# EAGLE schematic Controller (EAGLE 6.5.0)
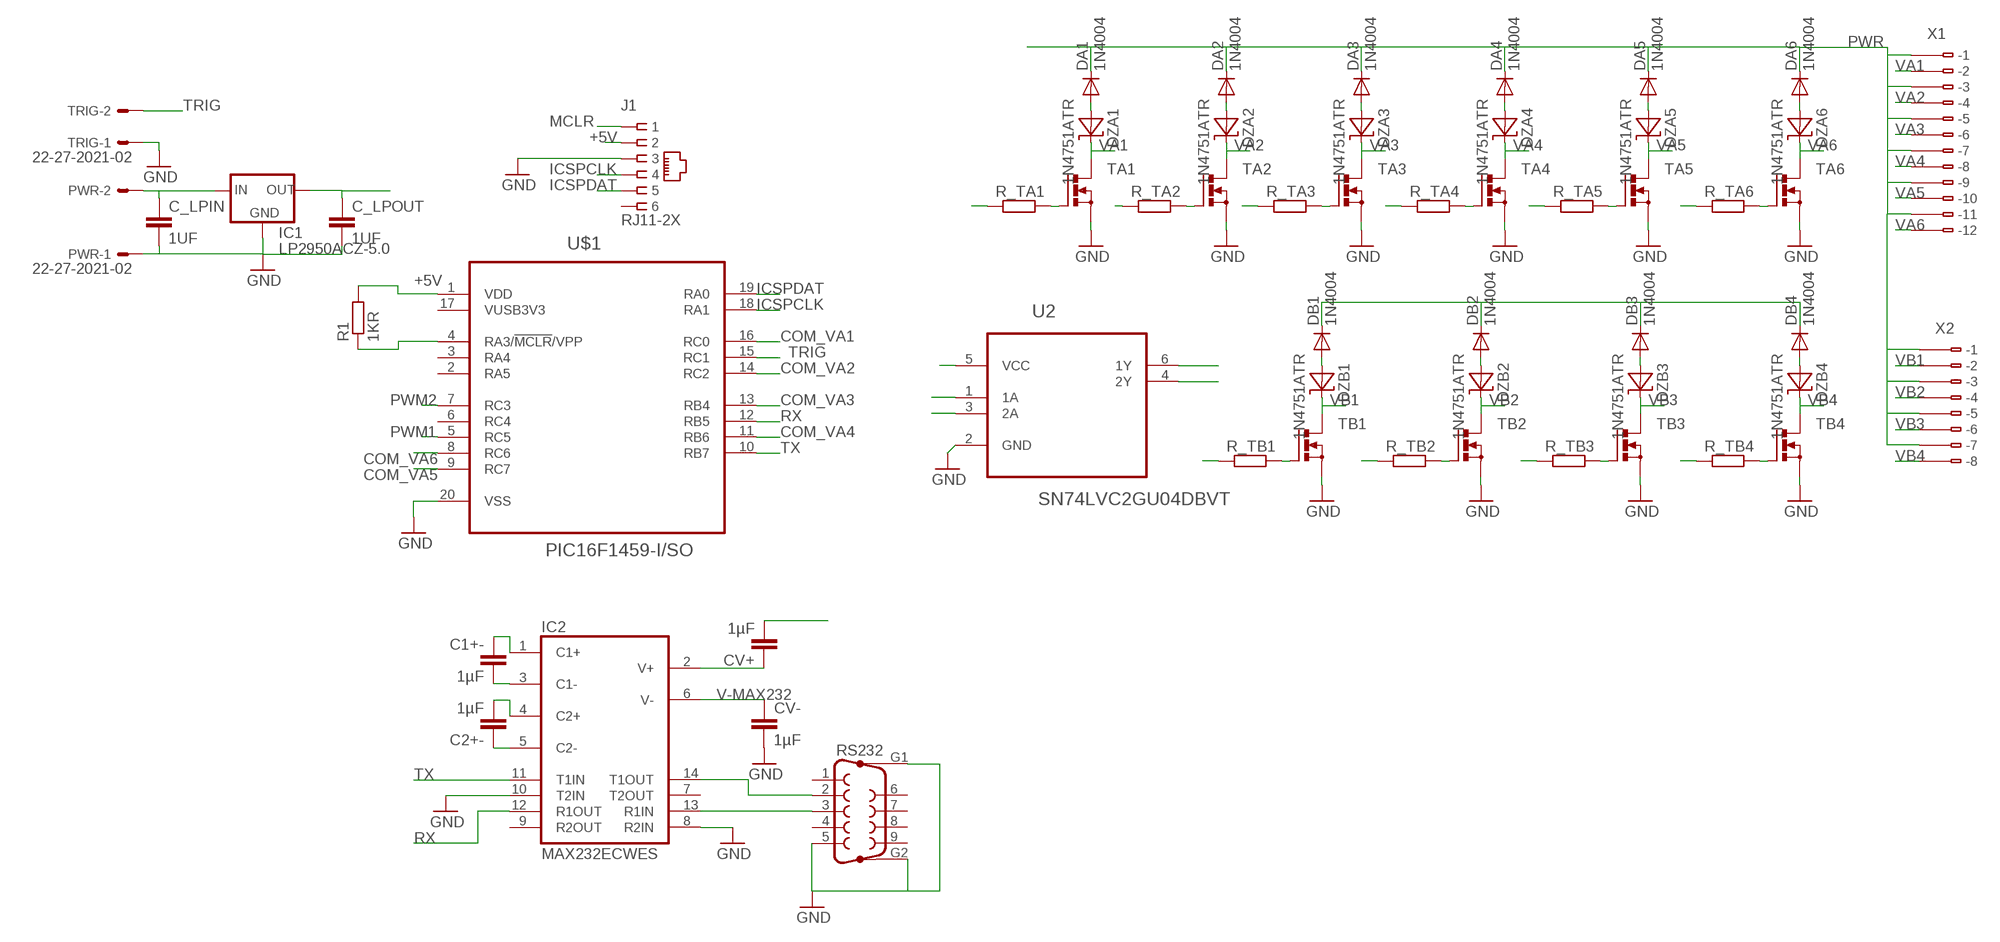
[diagram p0: schematic, sheet 1]

## Parts
C1+-  1µF  C-EUC0805  [C0805]
C2+-  1µF  C-EUC0805  [C0805]
C_LPIN  1UF  C-EUC0805  [C0805]
C_LPOUT  1UF  C-EUC0805  [C0805]
CV+  1µF  C-EUC0805  [C0805]
CV-  1µF  C-EUC0805  [C0805]
DA1  1N4004  [DO41-10]
DA2  1N4004  [DO41-10]
DA3  1N4004  [DO41-10]
DA4  1N4004  [DO41-10]
DA5  1N4004  [DO41-10]
DA6  1N4004  [DO41-10]
DB1  1N4004  [DO41-10]
DB2  1N4004  [DO41-10]
DB3  1N4004  [DO41-10]
DB4  1N4004  [DO41-10]
DZA1  1N4751ATR  [DO41-7]
DZA2  1N4751ATR  [DO41-7]
DZA3  1N4751ATR  [DO41-7]
DZA4  1N4751ATR  [DO41-7]
DZA5  1N4751ATR  [DO41-7]
DZA6  1N4751ATR  [DO41-7]
DZB1  1N4751ATR  [DO41-7]
DZB2  1N4751ATR  [DO41-7]
DZB3  1N4751ATR  [DO41-7]
DZB4  1N4751ATR  [DO41-7]
IC1  LP2950ACZ-5.0  [TO92]
IC2  MAX232ECWES  [SO16]
J1  RJ11-2X  [RJ11-NO_SHIELD]
PWR  22-27-2021-02  [6410-02]
R1  1KR  R-EU_R0805  [R0805]
R_TA1  R-EU_R0805  [R0805]
R_TA2  R-EU_R0805  [R0805]
R_TA3  R-EU_R0805  [R0805]
R_TA4  R-EU_R0805  [R0805]
R_TA5  R-EU_R0805  [R0805]
R_TA6  R-EU_R0805  [R0805]
R_TB1  R-EU_R0805  [R0805]
R_TB2  R-EU_R0805  [R0805]
R_TB3  R-EU_R0805  [R0805]
R_TB4  R-EU_R0805  [R0805]
RS232  F09HP  [F09HP]
TA1  BSS316N  [INF-PG-SOT23_N_1PRIMARY]
TA2  BSS316N  [INF-PG-SOT23_N_1PRIMARY]
TA3  BSS316N  [INF-PG-SOT23_N_1PRIMARY]
TA4  BSS316N  [INF-PG-SOT23_N_1PRIMARY]
TA5  BSS316N  [INF-PG-SOT23_N_1PRIMARY]
TA6  BSS316N  [INF-PG-SOT23_N_1PRIMARY]
TB1  BSS316N  [INF-PG-SOT23_N_1PRIMARY]
TB2  BSS316N  [INF-PG-SOT23_N_1PRIMARY]
TB3  BSS316N  [INF-PG-SOT23_N_1PRIMARY]
TB4  BSS316N  [INF-PG-SOT23_N_1PRIMARY]
TRIG  22-27-2021-02  [6410-02]
U2  SN74LVC2GU04DBVT  [SOT95P280X145-6N]
U$1  PIC16F1459-I/SO  [SOIC127P1030X265-20N]
X1  233-212  [233-212]
X2  233-208  [233-208]

## Nets
+5V: C_LPOUT.1 CV+.2 IC1.1(OUT) J1.2 R1.2 U2.5(VCC) U$1.1(VDD)
COM_VA1: R_TA1.1 U$1.16(RC0)
COM_VA2: R_TA2.1 U$1.14(RC2)
COM_VA3: R_TA3.1 U$1.13(RB4)
COM_VA4: R_TA4.1 U$1.11(RB6)
COM_VA5: R_TA5.1 U$1.9(RC7)
COM_VA6: R_TA6.1 U$1.8(RC6)
GND: C_LPIN.2 C_LPOUT.2 CV-.2 IC1.2(GND) IC2.8(R2IN) IC2.10(T2IN) J1.3 PWR.1 RS232.5 RS232.G1 RS232.G2 TA1.2(S) TA2.2(S) TA3.2(S) TA4.2(S) TA5.2(S) TA6.2(S) TB1.2(S) TB2.2(S) TB3.2(S) TB4.2(S) TRIG.1 U2.2(GND) U$1.20(VSS)
ICSPCLK: J1.4 U$1.18(RA1)
ICSPDAT: J1.5 U$1.19(RA0)
MCLR: J1.1 R1.1 U$1.4(RA3/!MCLR!/VPP)
N$1: DA1.A DZA1.A
N$2: DA2.A DZA2.A
N$3: C1+-.1 IC2.1(C1+)
N$4: DA3.A DZA3.A
N$5: C2+-.2 IC2.4(C2+)
N$6: DA4.A DZA4.A
N$7: IC2.14(T1OUT) RS232.2
N$8: IC2.13(R1IN) RS232.3
N$9: DA5.A DZA5.A
N$10: DA6.A DZA6.A
N$11: R_TA1.2 TA1.1(G)
N$12: R_TA2.2 TA2.1(G)
N$13: R_TA3.2 TA3.1(G)
N$14: R_TA4.2 TA4.1(G)
N$15: R_TA5.2 TA5.1(G)
N$16: R_TA6.2 TA6.1(G)
N$17: DB1.A DZB1.A
N$18: R_TB1.2 TB1.1(G)
N$19: DB2.A DZB2.A
N$20: R_TB2.2 TB2.1(G)
N$21: DB3.A DZB3.A
N$22: C1+-.2 IC2.3(C1-)
N$23: R_TB3.2 TB3.1(G)
N$24: DB4.A DZB4.A
N$25: R_TB4.2 TB4.1(G)
N$30: C2+-.1 IC2.5(C2-)
N$31: CV+.1 IC2.2(V+)
PWM1: R_TB1.1 U2.1(1A) U$1.5(RC5)
PWM1_INV: R_TB3.1 U2.6(1Y)
PWM2: R_TB2.1 U2.3(2A) U$1.7(RC3)
PWM2_INV: R_TB4.1 U2.4(2Y)
PWR: C_LPIN.1 DA1.C DA2.C DA3.C DA4.C DA5.C DA6.C IC1.3(IN) PWR.2 X1.B1(B-1) X1.B3(B-3) X1.B5(B-5) X1.B7(B-7) X1.B9(B-9) X1.B11(B-11) X2.B1(B-1) X2.B3(B-3) X2.B5(B-5) X2.B7(B-7)
PWR1: DB1.C DB2.C DB3.C DB4.C
RX: IC2.12(R1OUT) U$1.12(RB5)
TRIG: TRIG.2 U$1.15(RC1)
TX: IC2.11(T1IN) U$1.10(RB7)
V-MAX232: CV-.1 IC2.6(V-)
VA1: DZA1.C TA1.3(D) X1.B2(B-2)
VA2: DZA2.C TA2.3(D) X1.B4(B-4)
VA3: DZA3.C TA3.3(D) X1.B6(B-6)
VA4: DZA4.C TA4.3(D) X1.B8(B-8)
VA5: DZA5.C TA5.3(D) X1.B10(B-10)
VA6: DZA6.C TA6.3(D) X1.B12(B-12)
VB1: DZB1.C TB1.3(D) X2.B2(B-2)
VB2: DZB2.C TB2.3(D) X2.B4(B-4)
VB3: DZB3.C TB3.3(D) X2.B6(B-6)
VB4: DZB4.C TB4.3(D) X2.B8(B-8)
Unconnected: IC2.7(T2OUT) IC2.9(R2OUT) J1.6 RS232.1 RS232.4 RS232.6 RS232.7 RS232.8 RS232.9 U$1.2(RA5) U$1.3(RA4) U$1.6(RC4) X1.A1(-1) X1.A2(-2) X1.A3(-3) X1.A4(-4) X1.A5(-5) X1.A6(-6) X1.A7(-7) X1.A8(-8) X1.A9(-9) X1.A10(-10) X1.A11(-11) X1.A12(-12) X2.A1(-1) X2.A2(-2) X2.A3(-3) X2.A4(-4) X2.A5(-5) X2.A6(-6) X2.A7(-7) X2.A8(-8)

## Power pins joined to a net without a drawn wire
GND: IC2.15(GND)
VCC: IC2.16(VCC)
VUSB3V3: U$1.17(VUSB3V3)

## Library data of the parts
C1+- C2+- C_LPIN C_LPOUT CV+ CV- = rcl:C-EU: CAPACITOR, European symbol; OC_FARNELL: 2494199
DA1-DA6 DB1-DB4 = diode:1N4004: DIODE general purpose rectifier, 1 A; OC_FARNELL: 2295710
DZA1-DZA6 DZB1-DZB4 = diode:1N4751ATR; OC_FARNELL: 2453736
IC1 = v-reg:LP2950?*: Source: http://cache.national.com/ds/LP/LP2950.pdf; OC_FARNELL: 9489460
IC2 = maxim-6b:MAX232ECWE: RS232 TRANSEIVER; OC_FARNELL: 2511968
J1 = con-tycoelectronics:RJ11: CORCOM Modular RJ Jacks No Shield Source: www.tycoelectronics.com .. ENG_DS_1654001_1099_RJ_L_0507.pdf; OC_FARNELL: 3363132; OC_NEWARK: unknown
PWR TRIG = con-molex:22-?-02: CONNECTOR wire to board 2.54 mm (.1 inch) pitch header; OC_FARNELL: 9731148+1654528+1462641; OC_NEWARK: unknown
R1 = rcl:R-EU_: RESISTOR, European symbol; OC_FARNELL: 9332383
R_TA1-R_TA6 R_TB1-R_TB4 = rcl:R-EU_: RESISTOR, European symbol
RS232 = con-subd:F09HP: SUB-D; OC_FARNELL: 1084701; OC_NEWARK: unknown
TA1-TA6 TB1-TB4 = INF-PG-SOT23_N:BSS316N; OC_FARNELL: 2432720
U2 = texas:SN74LVC2GU04DBVT: SN74LVC2GU04 DUAL INVERTER GATE; MPN: SN74LVC2GU04DBVT; OC_FARNELL: 1741225; OC_NEWARK: 34R8927; PACKAGE: SOT-23-6; SUPPLIER: Texas Instruments
U$1 = PIC16F1459:PIC16F1459-I/SO: 8-Bit USB Microcontrollers,SOIC-20; MPN: PIC16F1459-I/SO; OC_FARNELL: 2305817; OC_NEWARK: 83T7220; PACKAGE: SOIC-20; SUPPLIER: MICROCHIP
X1 = con-wago:233-212: WAGO Cage Clamp; MPN: 233-212; OC_FARNELL: 1283538; OC_NEWARK: 28K9068
X2 = con-wago:233-208: WAGO Cage Clamp; MPN: 233-208; OC_FARNELL: 1283537; OC_NEWARK: 28K9065